# EAGLE design heater (EAGLE 9.2.2)
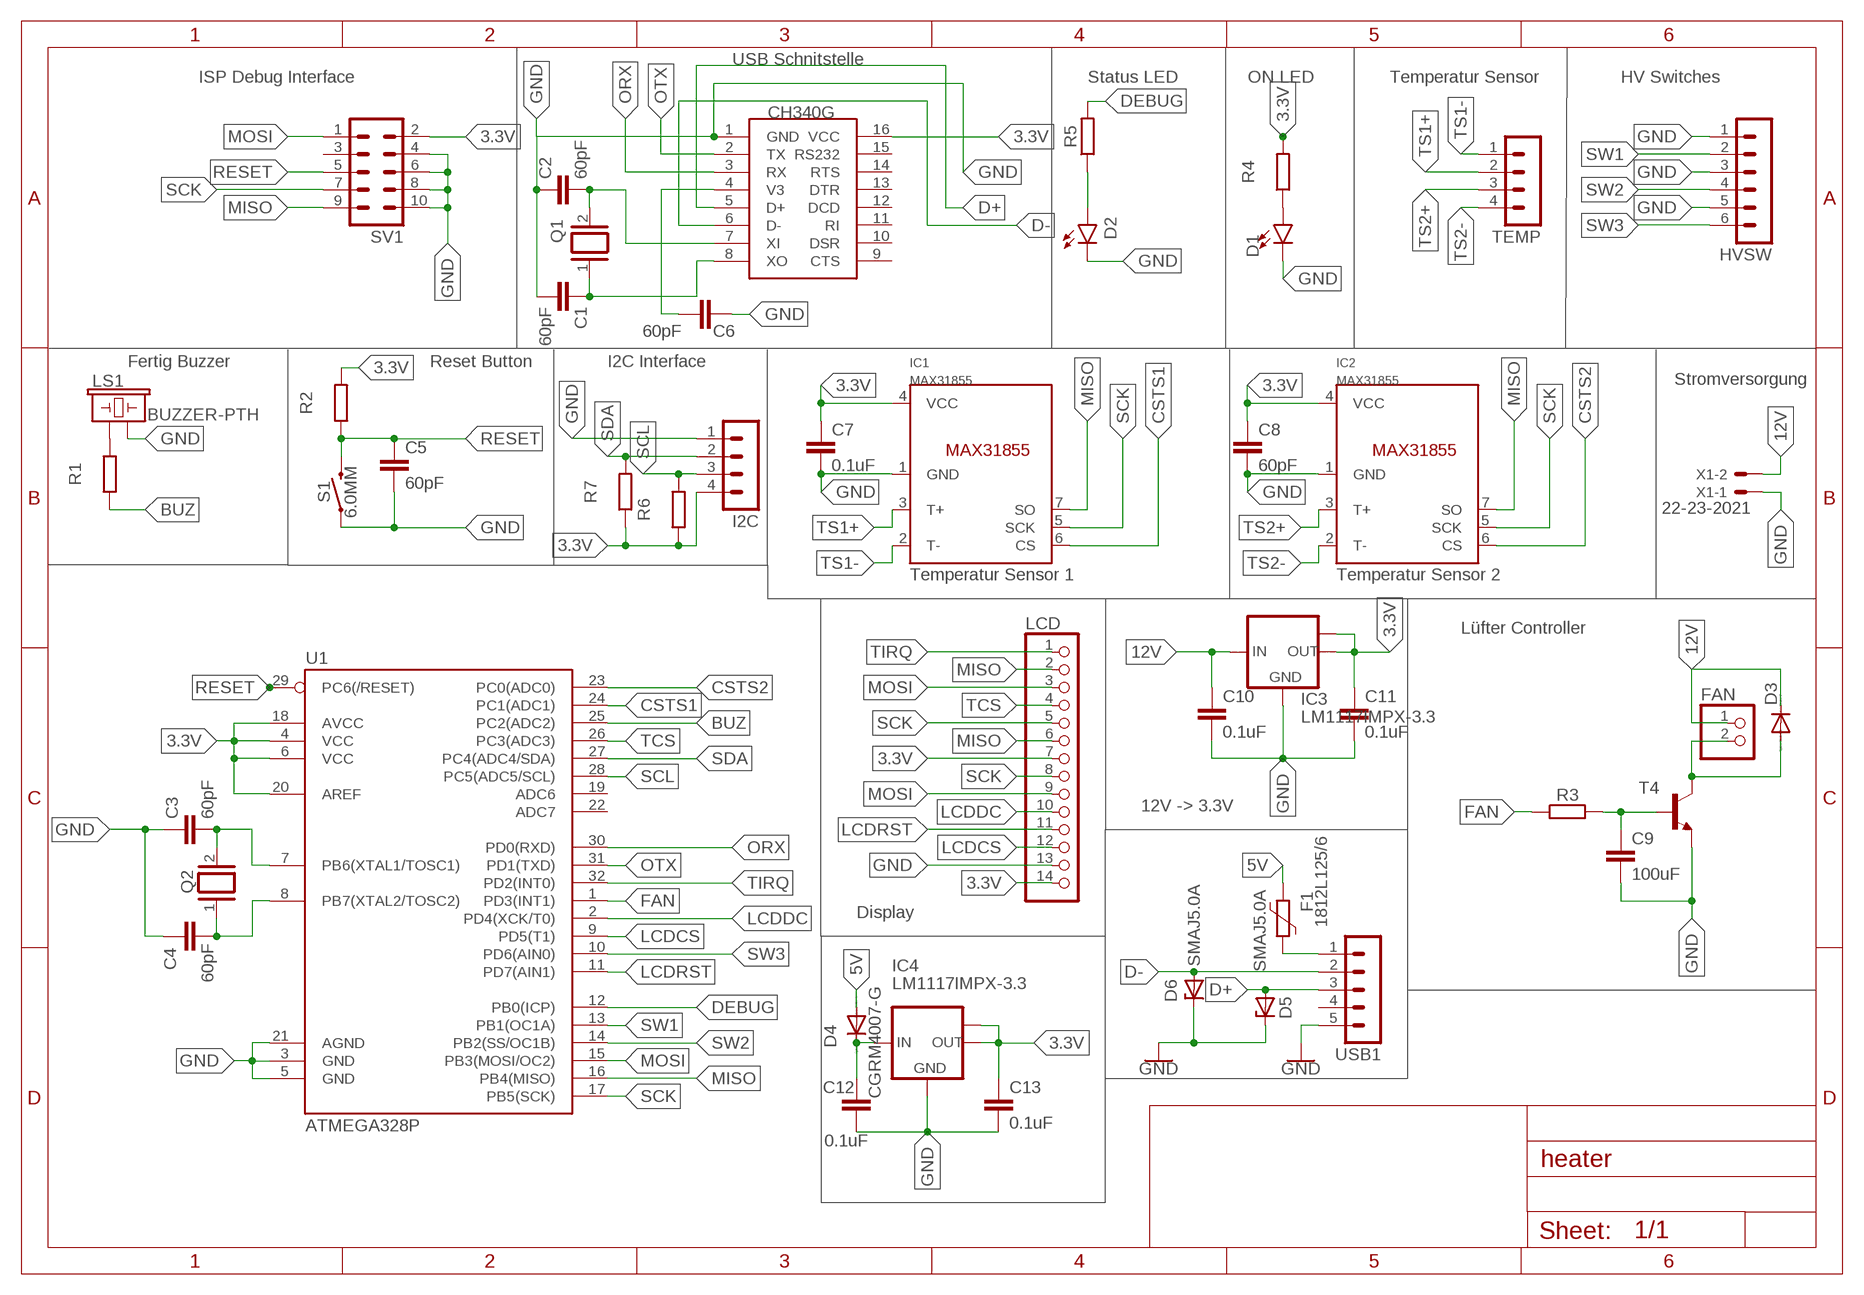
[diagram p0: schematic, sheet 1]

## Parts
C1  60pF  C-EUC0805  [C0805]
C2  60pF  C-EUC0805  [C0805]
C3  60pF  C-EUC0805  [C0805]
C4  60pF  C-EUC0805  [C0805]
C5  60pF  C-EUC0805  [C0805]
C6  60pF  C-EUC0805  [C0805]
C7  0.1uF  C-EUC0805  [C0805]
C8  60pF  C-EUC0805  [C0805]
C9  100uF  C-EUC0805  [C0805]
C10  0.1uF  C-EUC0805  [C0805]
C11  0.1uF  C-EUC0805  [C0805]
C12  0.1uF  C-EUC0805  [C0805]
C13  0.1uF  C-EUC0805  [C0805]
D1  LED5MM  [LED_5MM]
D2  LED5MM  [LED_5MM]
D3  CGRM4007-G  [SOD-123_MINI-SMA]
D4  CGRM4007-G  [SOD-123_MINI-SMA]
D5  SMAJ5.0A  [DO214AC]
D6  SMAJ5.0A  [DO214AC]
F1  1812L125/6  [1812L]
FAN  PINHD-1X2  [1X02]
HVSW  MA06-1  [MA06-1]
I2C  MA04-1  [MA04-1]
IC1  MAX31855  [SOIC8]
IC2  MAX31855  [SOIC8]
IC3  LM1117IMPX-3.3  [SOT223]
IC4  LM1117IMPX-3.3  [SOT223]
LCD  PINHD-1X14  [1X14]
LS1  BUZZER-PTH  [BUZZER-12MM]
Q1  XTAL/S  [QS]
Q2  XTAL/S  [QS]
R1  R-EU_M0805  [M0805]
R2  R-EU_M0805  [M0805]
R3  R-EU_M0805  [M0805]
R4  R-EU_M0805  [M0805]
R5  R-EU_M0805  [M0805]
R6  R-EU_M0805  [M0805]
R7  R-EU_M0805  [M0805]
S1  6.0MM  MOMENTARY-SWITCH-SPST-PTH-6.0MM  [TACTILE_SWITCH_PTH_6.0MM]
SV1  MA05-2  [MA05-2]
T4  TRANSISTOR_2SC2509V  [TRANSISTOR_TO220AV]
TEMP  MA04-1  [MA04-1]
U1  ATMEGA328P  ATMEGA328P_TQFP  [TQFP32-08]
U$1  CH340G  [SOIC16]
USB1  MA05-1  [MA05-1]
X1  22-23-2021  [22-23-2021]

## Nets
3.3V: C7.1 C8.1 C11.1 C13.1 I2C.4 IC1.4(VCC) IC2.4(VCC) IC3.2(OUT) IC3.TAB(OUT1) IC4.2(OUT) IC4.TAB(OUT1) LCD.7 LCD.14 R2.2 R4.2 R6.1 R7.1 SV1.2 U1.4(VCC) U1.6(VCC) U1.18(AVCC) U1.20(AREF) U$1.16(VCC)
5V: D4.A F1.2
12V: C10.1 D3.C FAN.1 IC3.3(IN) X1.2
BUZ: R1.1 U1.25(PC2(ADC2))
CSTS1: IC1.6(CS) U1.24(PC1(ADC1))
CSTS2: IC2.6(CS) U1.23(PC0(ADC0))
D+: D5.A U$1.5(D+) USB1.3
D-: D6.A U$1.6(D-) USB1.2
DEBUG: R5.2 U1.12(PB0(ICP))
FAN: R3.1 U1.1(PD3(INT1))
FAN_PRE: D3.A FAN.2 T4.2(C)
GND: C1.2 C2.1 C3.1 C4.1 C5.2 C6.1 C7.2 C8.2 C9.2 C10.2 C11.2 C12.2 C13.2 D1.K(C) D2.K(C) D5.C D6.C HVSW.1 HVSW.3 HVSW.5 I2C.1 IC1.1(GND) IC2.1(GND) IC3.1(GND) IC4.1(GND) LCD.13 LS1.- S1.1 SV1.4 SV1.6 SV1.8 SV1.10 T4.3(E) U1.3(GND) U1.5(GND) U1.21(AGND) U$1.1(GND) USB1.5 X1.1
LCDCS: LCD.12 U1.9(PD5(T1))
LCDDC: LCD.10 U1.2(PD4(XCK/T0))
LCDRST: LCD.11 U1.11(PD7(AIN1))
MISO: IC1.7(SO) IC2.7(SO) LCD.2 LCD.6 SV1.9 U1.16(PB4(MISO))
MOSI: LCD.3 LCD.9 SV1.1 U1.15(PB3(MOSI/OC2))
N$1: C1.1 Q1.1 U$1.8(XO)
N$4: C2.2 Q1.2 U$1.7(XI)
N$6: C12.1 D4.C IC4.3(IN)
N$7: LS1.+ R1.2
N$8: C6.2 U$1.4(V3)
N$9: C9.1 R3.2 T4.1(B)
N$21: D1.A R4.1
N$22: D2.A R5.1
ORX: U1.30(PD0(RXD)) U$1.3(RX)
OTX: U1.31(PD1(TXD)) U$1.2(TX)
PRE5V: F1.1 USB1.1
RESET: C5.1 R2.1 S1.3 SV1.5 U1.29(PC6(/RESET))
SCK: IC1.5(SCK) IC2.5(SCK) LCD.5 LCD.8 SV1.7 U1.17(PB5(SCK))
SCL: I2C.3 R6.2 U1.28(PC5(ADC5/SCL))
SDA: I2C.2 R7.2 U1.27(PC4(ADC4/SDA))
SW1: HVSW.2 U1.13(PB1(OC1A))
SW2: HVSW.4 U1.14(PB2(SS/OC1B))
SW3: HVSW.6 U1.10(PD6(AIN0))
TCS: LCD.4 U1.26(PC3(ADC3))
TIRQ: LCD.1 U1.32(PD2(INT0))
TS1+: IC1.3(T+) TEMP.2
TS1-: IC1.2(T-) TEMP.1
TS2+: IC2.3(T+) TEMP.3
TS2-: IC2.2(T-) TEMP.4
XTAL1: C4.2 Q2.1 U1.8(PB7(XTAL2/TOSC2))
XTAL2: C3.2 Q2.2 U1.7(PB6(XTAL1/TOSC1))
Unconnected: SV1.3 U1.19(ADC6) U1.22(ADC7) U$1.9(CTS) U$1.10(DSR) U$1.11(RI) U$1.12(DCD) U$1.13(DTR) U$1.14(RTS) U$1.15(RS232) USB1.4

## Notes on the sheet
- USB Schnitstelle
- ISP Debug Interface | Status LED | ON LED | Temperatur Sensor | HV Switches
- Fertig Buzzer | Reset Button | I2C Interface
- Stromversorgung
- Temperatur Sensor 1 | Temperatur Sensor 2
- Lüfter Controller
- 12V -> 3.3V
- Display

## Library data of the parts
C1-C13 = rcl:C-EU: CAPACITOR, European symbol; SPICEPREFIX: C
D1 D2 = SparkFun-LED:LED: LED (Generic) Standard schematic elements and footprints for 5mm, 3mm, 1206, and 0603 sized LEDs. Generic LEDs with no color specified.
D3 D4 = diode:CGRM400*-G: Molded plasitc,JEDEC SOD-123/Mini SMA Source: Comchip CGRM4001-G.pdf
D5 D6 = smaj_10:SMAJ*A: SMAJ Series TVS Diodes Source: http://www.littelfuse.com/~/media/electronics/datasheets/tvs_diodes/littelfuse_tvs_diode_smaj_datasheet.pdf.pdf; MF: Littelfuse; MPN: SMAJ5.0A; OC_FARNELL: 1827607; OC_NEWARK: 71J2029
F1 = polyfuse-smd_10:?: Polyfuse Resettable PTC Source: http://www.littelfuse.com/products/resettable-ptcs.aspx; MF: Littelfuse; MPN: 1812L125/6; OC_FARNELL: unknown; OC_NEWARK: unknown
FAN = pinhead:PINHD-1X2: PIN HEADER
HVSW = con-lstb:MA06-1: PIN HEADER; OC_FARNELL: unknown; OC_NEWARK: unknown
I2C TEMP = con-lstb:MA04-1: PIN HEADER; OC_FARNELL: unknown; OC_NEWARK: unknown
IC1 IC2 = AlexW-Eagle-Libraries:MAX31855
IC3 IC4 = lm1117:LM1117IMPX-*
LCD = pinhead:PINHD-1X14: PIN HEADER
LS1 = SparkFun-Electromechanical:BUZZER: Buzzer Small round buzzers that operate around the audible 2kHz range. You can use these as speakers to create simple music or user interfaces. Variant Overview: PTH - Mini Speaker - PC Mount 12mm 2.048kHz <https://www.sparkfun.com/products/7950> PTH_KIT - Mini Speaker - PC Mount 12mm 2.048kHz <https://www.sparkfun.com/products/7950> KIT simplifies soldering by adding stop mask to one side of the pads. PTH_NO_SILK - Mini Speaker - PC Mount 12mm 2.048kHz <https://www.sparkfun.com/products/7950> No silkscreen indicator of buzzer outline. PTH_KIT_NO_SILK - Mini Speaker - PC Mount 12mm 2.048kHz <https://www.sparkfun.com/products/7950> KIT package w/o silkscreen SMD - Buzzer Audio Magnetic (CCV-084B16) SMD buzzer used on, e.g. the LilyPad Buzzer <https://www.sparkfun.com/products/8463> and RFID USB Reader <https://www.sparkfun.com/products/9963>. SMD_KIT - Buzzer Audio Magnetic (CCV-084B16) SMD Buzzer with elongated pins to make soldering easier. Used on the SparkFun Simon Says - Surface Mount Soldering Kit <https://www.sparkfun.com/products/10935>.; PROD_ID: COMP-08253; SF_SKU: COM-07950
Q1 Q2 = special:XTAL/S: CRYSTAL
R1-R7 = rcl:R-EU_: RESISTOR, European symbol; SPICEPREFIX: R
S1 = SparkFun-Switches:MOMENTARY-SWITCH-SPST: Momentary Switch (Pushbutton) - SPST Normally-open (NO) SPST momentary switches (buttons, pushbuttons). Variants PTH-12MM - 12mm square, through-hole Momentary Pushbutton Switch - 12mm Square <https://www.sparkfun.com/products/9190> (COM-09190) PTH-6.0MM, PTH-6.0MM-KIT - 6.0mm square, through-hole Mini Pushbutton Switch <https://www.sparkfun.com/products/97> (COM-00097) KIT package intended for soldering kit's - only one side of pads' copper is exposed. PTH-RIGHT-ANGLE-KIT - Right-angle, through-hole Right Angle Tactile Button <https://www.sparkfun.com/products/10791> - Used on SparkFun BigTime Watch Kit <https://www.sparkfun.com/products/11734> SMD-12MM - 12mm square, surface-mount Tactile Button - SMD (12mm) <https://www.sparkfun.com/products/12993> (COM-12993) Used on SparkFun PicoBoard <https://www.sparkfun.com/products/11888> SMD-4.5MM - 4.5mm Square Trackball Switch Used on SparkFun Blackberry Trackballer Breakout <https://www.sparkfun.com/products/13169> SMD-4.6MMX2.8MM - 4.60mm x 2.80mm, surface mount Used on SparkFun SAMD21 Mini Breakout <https://www.sparkfun.com/products/13664> SMD-5.2MM, SMD-5.2-REDUNDANT - 5.2mm square, surface-mount Mini Pushbutton Switch - SMD <https://www.sparkfun.com/products/8720> (COM-08720) Used on Arduino Pro Mini <https://www.sparkfun.com/products/11114> REDUNDANT package connects both switch circuits together SMD-6.0X3.5MM - 6.0 x 3.5mm, surface mount Momentary Reset Switch SMD <https://www.sparkfun.com/products/8229> (COM-08229) SMD-6.2MM-TALL - 6.2mm square, surface mount Tactile Button - SMD (6mm) <https://www.sparkfun.com/products/12992> Used on SparkFun Digital Sandbox <https://www.sparkfun.com/products/12651> SMD-RIGHT-ANGLE - Right-angle, surface mount Used on SparkFun Block for Intel® Edison - Arduino <https://www.sparkfun.com/products/13036>; PROD_ID: SWCH-08441; SF_SKU: COM-00097
SV1 = con-lstb:MA05-2: PIN HEADER; OC_FARNELL: unknown; OC_NEWARK: unknown
T4 = rgb:TRANSISTOR_2SC2509: NPN Epitaxial Planar Transistor RF Power Amplivier Source: www.Datasheet4U.com 2SC2905.pdf
U1 = SparkFun-IC-Microcontroller:ATMEGA328P_TQFP: Popular 328P in QFP Storefront component: ATmega328 - TQFP <https://www.sparkfun.com/products/13448> (COM-13448) Datasheet <http://www.sparkfun.com/datasheets/Components/SMD/ATMega328.pdf> SparkFun Products SparkFun RedBoard - Programmed with Arduino <https://www.sparkfun.com/products/12757> (DEV-12757) Arduino Pro Mini 328 - 5V/16MHz <https://www.sparkfun.com/products/11113> (DEV-11113) Arduino Pro Mini 328 - 3.3V/8MHz <https://www.sparkfun.com/products/11114> (DEV-11114) SparkFun OpenLog <https://www.sparkfun.com/products/13712> (DEV-13712) SparkFun MicroView - OLED Arduino Module <https://www.sparkfun.com/products/12923> (DEV-12923) SparkFun Digital Sandbox <https://www.sparkfun.com/products/12651> (DEV-12651) SparkFun PicoBoard <https://www.sparkfun.com/products/11888> (WIG-11888) Arduino Fio <https://www.sparkfun.com/products/10116> (DEV-10116) LilyPad Arduino 328 Main Board <https://www.sparkfun.com/products/13342> (DEV-13342) SparkFun RedStick <https://www.sparkfun.com/products/13741> (DEV-13741) LilyPad MP3 <https://www.sparkfun.com/products/11013> (DEV-11013) LilyPad Arduino SimpleSnap <https://www.sparkfun.com/products/10941> (DEV-10941) SparkFun Stepoko <https://www.sparkfun.com/products/13899> (ROB-13899) SparkFun Geiger Counter <https://www.sparkfun.com/products/11345> (SEN-11345) SparkFun EL Sequencer <https://www.sparkfun.com/products/12781> (COM-12781) Arduino Pro 328 - 5V/16MHz <https://www.sparkfun.com/products/10915> (DEV-10915) CryptoCape <https://www.sparkfun.com/products/12773> (DEV-12773) SparkFun IR Thermometer Evaluation Board - MLX90614 <https://www.sparkfun.com/products/10740> (SEN-10740) SparkFun RedBot Mainboard <https://www.sparkfun.com/products/12097> (ROB-12097) Arduino Pro 328 - 3.3V/8MHz <https://www.sparkfun.com/products/10914> (DEV-10914) SparkFun Block for Intel® Edison - Arduino <https://www.sparkfun.com/products/13036> (DEV-13036) SparkFun Simon Says - Surface Mount Soldering Kit <https://www.sparkfun.com/products/10935> (KIT-10935) SparkFun 7-Segment Serial Display - Red <https://www.sparkfun.com/products/11441> (COM-11441) SparkFun 7-Segment Serial Display - White <https://www.sparkfun.com/products/11629> (COM-11629) SparkFun 7-Segment Serial Display - Yellow <https://www.sparkfun.com/products/11443> (COM-11443) SparkFun 7-Segment Serial Display - Kelly Green <https://www.sparkfun.com/products/11440> (COM-11440) SparkFun 7-Segment Serial Display - Blue <https://www.sparkfun.com/products/11442> (COM-11442) SparkFun OpenSegment Serial Display - 20mm (Blue) <https://www.sparkfun.com/products/11647> (COM-11647) SparkFun OpenSegment Serial Display - 20mm (Green) <https://www.sparkfun.com/products/11646> (COM-11646) SparkFun OpenSegment Serial Display - 20mm (White) <https://www.sparkfun.com/products/11648> (COM-11648) SparkFun OpenSegment Serial Display - 20mm (Red) <https://www.sparkfun.com/products/11644> (COM-11644) SparkFun OpenSegment Serial Display - 20mm (Yellow) <https://www.sparkfun.com/products/11645> (COM-11645) SparkFun OpenSegment Shield <https://www.sparkfun.com/products/13190> (DEV-13190); PROD_ID: IC-09069; VALUE: ATMEGA328P_TQFP
U$1 = ch340g:CH340G
USB1 = con-lstb:MA05-1: PIN HEADER; OC_FARNELL: unknown; OC_NEWARK: unknown
X1 = con-molex:22-23-2021: .100" (2.54mm) Center Header - 2 Pin; MF: MOLEX; MPN: 22-23-2021; OC_FARNELL: 1462926; OC_NEWARK: 25C3832

## Board
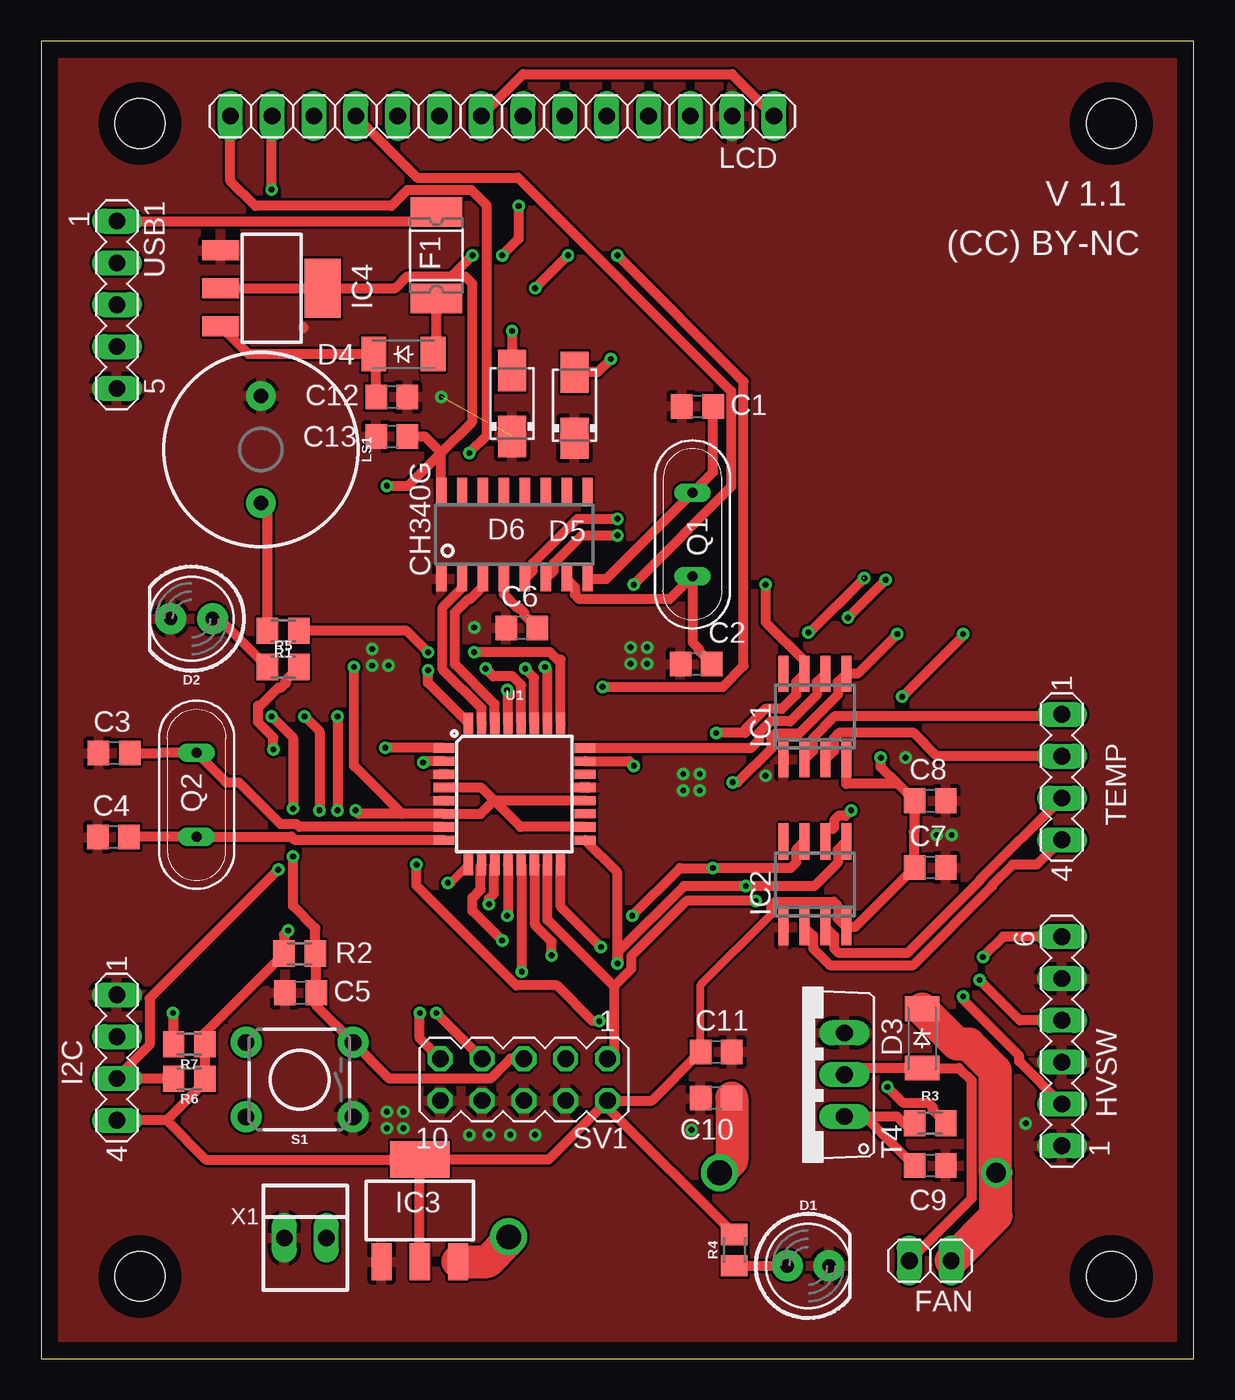
[diagram p1: board, top side]
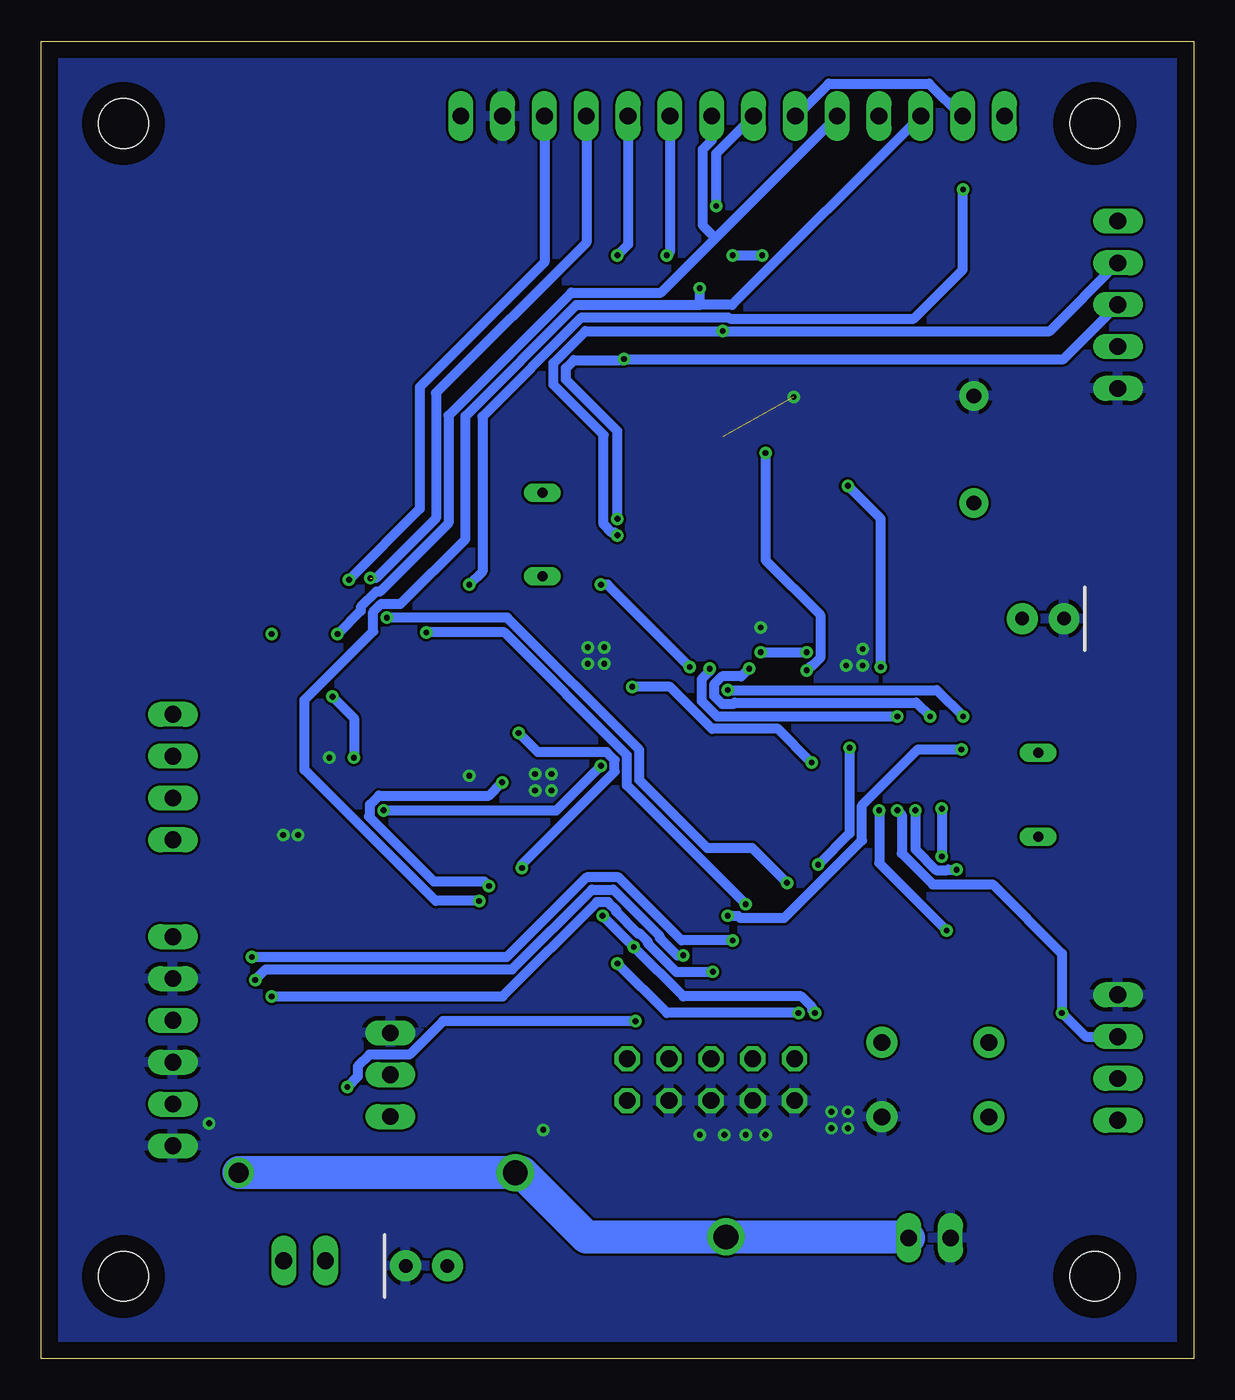
[diagram p2: board, bottom side, seen from below]

Size 70 x 80 mm. Coordinates in mm from the lower left corner, seen from the top.
Outline: 0,0 70,0 70,80 0,80 0,0
Copper layers (1*16): Top 0.035mm / dielectric 1.5mm / Bottom 0.035mm
Design rules "default": minimum track width 6mil, minimum drill 0.35mm, track to track 6mil, track to pad 6mil, pad to pad 6mil, via to via 6mil, smd to smd 6mil, copper to edge 40mil, drill to drill 6mil, minimum pad ring 10mil, minimum via ring 8mil, stop-mask expansion 4mil, vias tented up to drill 0mil, thermal gap 10mil
Holes 3 mm at 65,5 6,5 6,75 65,75

### Footprints (pad centres in the part's own frame; a part is rotated, then mirrored left to right if it is on the bottom)
C0805 = smd 1.3 x 1.5: 1 -0.95,0; 2 0.95,0
LED_5MM = drill 0.813 pad 1.88: A -1.27,0; K 1.27,0
SOD-123_MINI-SMA = smd 1.5 x 2.1: A 1.8,0; C -1.8,0
DO214AC = smd 2.5 x 1.7: A 2,0; C -2,0
1812L = smd 1.78 x 3.15: 1 -2.62,0; 2 2.62,0
1X02 = drill 1.016 long: 1 -1.27,0; 2 1.27,0
MA06-1 = drill 1.016 long: 1 -6.35,0; 2 -3.81,0; 3 -1.27,0; 4 1.27,0; 5 3.81,0; 6 6.35,0
MA04-1 = drill 1.016 long: 1 -3.81,0; 2 -1.27,0; 3 1.27,0; 4 3.81,0
SOIC8 = smd 0.6 x 2.2: 1 -1.905,-2.6; 2 -0.635,-2.6; 3 0.635,-2.6; 4 1.905,-2.6; 5 1.905,2.6; 6 0.635,2.6; 7 -0.635,2.6; 8 -1.905,2.6
SOT223 = smd 1.219 x 2.235: 1 -2.311,-3.099; 2 0,-3.099; 3 2.311,-3.099 | smd 3.6 x 2.2: TAB 0,3.099
1X14 = drill 1.016 long: 1 -16.51,0; 2 -13.97,0; 3 -11.43,0; 4 -8.89,0; 5 -6.35,0; 6 -3.81,0; 7 -1.27,0; 8 1.27,0; 9 3.81,0; 10 6.35,0; 11 8.89,0; 12 11.43,0; 13 13.97,0; 14 16.51,0
BUZZER-12MM = drill 0.9 pad 1.778: + 3.25,0; - -3.25,0
QS = drill 0.61 long: 1 -2.54,0; 2 2.54,0
M0805 = smd 1.3 x 1.6: 1 -0.95,0; 2 0.95,0
TACTILE_SWITCH_PTH_6.0MM = drill 1.016 pad 1.88: 1 -3.251,2.261; 2 3.251,2.261; 3 -3.251,-2.261; 4 3.251,-2.261
MA05-2 = drill 1.016 octagon: 1 -5.08,-1.27; 2 -5.08,1.27; 3 -2.54,-1.27; 4 -2.54,1.27; 5 0,-1.27; 6 0,1.27; 7 2.54,-1.27; 8 2.54,1.27; 9 5.08,-1.27; 10 5.08,1.27
TRANSISTOR_TO220AV = drill 1.016 long: 1 -2.54,-2.54; 2 0,-2.54; 3 2.54,-2.54
TQFP32-08 = smd 1.27 x 0.559: 1 -4.293,2.8; 2 -4.293,2; 3 -4.293,1.2; 4 -4.293,0.4; 5 -4.293,-0.4; 6 -4.293,-1.2; 7 -4.293,-2; 8 -4.293,-2.8; 17 4.293,-2.8; 18 4.293,-2; 19 4.293,-1.2; 20 4.293,-0.4; 21 4.293,0.4; 22 4.293,1.2; 23 4.293,2; 24 4.293,2.8 | smd 0.559 x 1.27: 9 -2.8,-4.293; 10 -2,-4.293; 11 -1.2,-4.293; 12 -0.4,-4.293; 13 0.4,-4.293; 14 1.2,-4.293; 15 2,-4.293; 16 2.8,-4.293; 25 2.8,4.293; 26 2,4.293; 27 1.2,4.293; 28 0.4,4.293; 29 -0.4,4.293; 30 -1.2,4.293; 31 -2,4.293; 32 -2.8,4.293
SOIC16 = smd 0.635 x 1.524: 1 -4.445,-2.695; 2 -3.175,-2.695; 3 -1.905,-2.695; 4 -0.635,-2.695; 5 0.635,-2.695; 6 1.905,-2.695; 7 3.175,-2.695; 8 4.445,-2.695; 9 4.445,2.695; 10 3.175,2.695; 11 1.905,2.695; 12 0.635,2.695; 13 -0.635,2.695; 14 -1.905,2.695; 15 -3.175,2.695; 16 -4.445,2.695
MA05-1 = drill 1.016 long: 1 -5.08,0; 2 -2.54,0; 3 0,0; 4 2.54,0; 5 5.08,0
22-23-2021 = drill 1 long: 1 -1.27,0; 2 1.27,0

### Placement (x,y rotation side)
C1  39.86,57.82 180 top
C2  39.79,42.18 0 top
C3  4.44,36.78 0 top
C4  4.39,31.68 0 top
C5  15.76,22.22 180 top
C6  29.19,44.38 0 top
C7  54,29.83 0 top
C8  54,33.88 0 top
C9  54,11.73 0 top
C10  41,15.83 180 top
C11  41,18.63 0 top
C12  21.3,58.4 0 top
C13  21.3,56 180 top
D1  46.59,5.64 0 top
D2  9.14,44.94 180 top
D3  53.5,19.45 270 top
D4  22,61 0 top
D5  32.4,57.9 90 top
D6  28.6,58 90 top
F1  24,67 270 top
FAN  54,5.96 180 top
HVSW  62,19.28 90 top
I2C  4.6,18.29 270 top
IC1  47,39 0 top
IC2  47,28.81 0 top
IC3  23,9 0 top
IC4  14,65 270 top
LCD  28,75.45 0 top
LS1  13.35,55.21 270 top
Q1  39.56,50.05 270 top
Q2  9.44,34.25 90 top
R1  14.7,44.2 180 top
R2  15.7,24.6 180 top
R3  54,14.3 180 top
R4  42.1,6.6 90 top
R5  14.7,42 0 top
R6  9,17 180 top
R7  9,19.1 180 top
S1  15.69,16.95 180 top
SV1  29.32,16.95 180 top
T4  46.25,17.25 90 top
TEMP  62,35.32 270 top
U1  28.75,34.29 0 top
U$1  28.74,50.05 0 top
USB1  4.6,64 270 top
X1  16.04,7.35 0 top

### Tracks (layer width: path | path; a pad name or v marks a point on that pad's centre or on a via)
3.3V  (via drill 0.35)
  Top 0.5: C11.1 40.05,22.71 44.34,27
  Top 0.6: IC1.4 48.91,34.91 52.02,34.91 | 52.02,34.91 C8.1 53.05,32.05 53,32 53,29.88 C7.1 49.43,26.21 IC2.4 48.39,26.73 48.39,27.5 48.12,27.76 44.61,27.76 44.34,27.5 44.34,27 | 24.3,55 U$1.16 | U1.20 27.5,33.9 | U1.4 26.71,34.69 27.5,33.9 | 27.5,33.9 26.69,33.09 U1.6 21.91,33.09 | 7.62,14.48 I2C.4 | SV1.2 37.1,15.68 C11.1 | 52.02,34.91 51,35.93 v51,36.5 | v19,42 19,36 21.91,33.09 | v21,53 22.3,53 24.3,55 | 21.91,33.09 19.31,33.09 v19.1,33.3 | v15,26 14.75,25.75 R2.2 9.95,19.8 R7.1 R6.1 9.95,16.81 7.62,14.48 | 56.06,43.94 v56,44 56,43.9 v52.3,40.2 | U1.18 29.11,32.29 27.5,33.9 | SV1.2 30.82,12.1 IC3.TAB | IC3.2 IC3.TAB | 24.3,55 26.2,56.9 26.2,65.28 25.76,65.72 24.92,65.72 | C13.1 23.3,56 24.3,55 | 7.62,14.48 10,12.1 IC3.TAB | R4.2 34.4,15.25 SV1.2 | IC4.2 IC4.TAB 21.52,65 22.24,65.72 24.92,65.72 | v29,70 29,68 v28,67 | v26.2,67 24.92,65.72 | LCD.14 41.96,78 29.28,78 LCD.7
  Bottom 0.6: v52.3,40.2 51,38.9 v51,36.5 | v19,42 19,51 v21,53 | v19.1,33.3 19.1,30.1 v15,26 | LCD.7 29,73.18 v29,70 | v28,67 v26.2,67 26.1,67
5V
  Top 0.6: F1.2 24,61.2 D4.A
12V  (via drill 1.2, 1.5)
  Top 2: D3.C 55.65,19.1 56.35,19.1 57.95,17.5 57.95,11.35 v58,11.3 58,8.69 FAN.1 | IC3.3 27.1,5.9 28.4,7.2 v28.4,7.4 | v41.2,11.3 41.95,12.05 C10.1
  Bottom 2: X1.2 17.36,7.4 v28.4,7.4 36.9,7.4 40.8,11.3 v41.2,11.3 v58,11.3
BUZ  (via drill 0.35)
  Top 0.6: U1.25 31.55,42.45 31.35,42.45 30.9,42.9 v26.3,42.9 | v23.5,42.9 22.2,44.2 R1.1
  Bottom 0.6: v26.3,42.9 v23.5,42.9
CSTS1
  Top 0.6: IC1.6 47.12,41.08 47.12,40.31 45.51,38.7 44.3,38.7 43.59,38 43.59,37.55 43.13,37.1 40.1,37.1 40.09,37.09 U1.24
CSTS2  (via drill 0.35)
  Top 0.6: U1.23 35.71,36.29 v36,36 | IC2.6 47.63,32.18 48.08,32.18 48.15,32.25 48.15,32.7 48.42,32.96 48.86,32.96 v49.2,33.3
  Bottom 0.6: v36,36 38.7,33.3 v49.2,33.3
D+  (via drill 0.35)
  Top 0.6: U$1.5 29.88,47.85 29.88,48.3 32.57,51 v35,51 | v34.6,60.7 33.8,59.9 D5.A
  Bottom 0.6: v35,51 35,56.33 38.13,59.46 38.13,60.14 37.64,60.63 34.67,60.63 v34.6,60.7 7.9,60.7 USB1.3
D-  (via drill 0.35)
  Top 0.6: U$1.6 31.14,47.85 31.14,48.3 32.84,50 v35,50 | v28.6,62.4 D6.A
  Bottom 0.6: v35,50 35.17,50.17 35.34,50.17 35.83,50.66 35.83,56.09 38.88,59.14 38.88,60.46 36.94,62.4 v28.6,62.4 8.74,62.4 USB1.2
DEBUG  (via drill 0.35)
  Top 0.6: U1.12 28.35,26.95 v28.3,26.9 | v14.1,37 14.1,37.73 13.17,38.66 13.17,39.67 13.32,39.67 14.4,40.75 14.59,40.75 14.85,41.01 14.85,41.2 R5.2
  Bottom 0.6: v28.3,26.9 27.68,26.9 27.54,26.77 24.86,26.77 20.15,31.48 20.15,33.6 16.75,37 v14.1,37
FAN  (via drill 0.35)
  Top 0.6: U1.1 v20.91,37.09 v20.9,37.1 | v51.4,16.5 52.35,15.55 53.89,15.55 54.15,15.29 54.15,15.1 R3.1 | v22.8,30 22.8,28.73 28.86,22.67 31.33,22.67 33.5,20.5 v33.9,20.5
  Bottom 0.6: v20.9,37.1 20.9,31.9 v22.8,30 | v51.4,16.5 50.77,17.13 50.77,17.75 50.05,18.46 47.64,18.46 45.6,20.5 v33.9,20.5
FAN_PRE
  Top 0.6: T4.2 49.19,17.65 D3.A 55.75,17.65 56.5,16.9 56.5,9.73 FAN.2
GND  (via drill 0.35)  (1 unrouted)
  Top 0.6: 15.94,62.65 15.94,62.6
  other vias: 44,35.4 36.8,42.2 26.3,44.4 39,35.5 20.1,43.1 52.5,36.5 54.4,31.8 55.3,31.8 24.3,58.4 39.5,13.9 26,13.6 27.2,13.6 28.5,13.6 30,13.6 59.8,14.3 20.1,42.1 21.1,42.1 36.8,43.2 35.8,43.2 35.8,42.2 40,35.5 39,34.5 40,34.5 21,15 22,15 21,14 22,14
  pour Top: -1,81 -1,-1 71,-1 71,81
  pour Bottom: -2,82 -2,-2 73,-2 73,82
LCDCS  (via drill 0.35)
  Top 0.5: U1.9 24.85,28.9
  Top 0.6: 24.85,28.9 v24.7,28.9 | v49,45 v51.3,47.3
  Bottom 0.6: v24.7,28.9 26.8,31 29.54,31 33.66,35.13 33.66,36.97 41.7,45 v49,45 | LCD.12 39.43,66.57 47,59 47,51.6 v51.3,47.3
LCDDC  (via drill 0.35)
  Top 0.6: U1.2 23.29,36.29 v23.2,36.2 | v35,67 42.66,59.34 42.66,42.06 41.4,40.8 v34.1,40.8
  Bottom 0.6: v34.1,40.8 31.8,40.8 29.25,38.25 25.25,38.25 v23.2,36.2 | v35,67 34.35,67.65 LCD.10
LCDRST  (via drill 0.35)  (1 unrouted)
  Top 0.6: v27.2,27.6 27.2,27.94 27.5,28.24 27.5,29.95 U1.11 | v46.6,44.1 46.7,44.1 v50,47.4
  Bottom 0.6: v27.2,27.6 34.42,34.82 34.42,36.66 41.86,44.1 v46.6,44.1 | LCD.11 36.89,67.77 46.02,58.64 46.02,51.05 49.66,47.4 49.9,47.4
MISO  (via drill 0.35)
  Top 0.6: v41,38 42.77,38 42.84,38.07 42.84,38.31 43.98,39.46 44.99,39.46 45.85,40.31 45.85,41.08 IC1.7 46.37,42.37 44,44.73 v44,47 | IC2.7 45.85,30.89 45.85,30.12 45.52,29.8 v40.8,29.8 38.8,29.8 v35.9,26.9 | SV1.9 23,19.46 v23,21 | v34,25 31.55,27.45 U1.16 | v14,71 14,75.42 LCD.2
  Bottom 0.6: v41,38 39.83,36.83 35.66,36.83 35.17,36.34 35.17,35.66 40.8,30.02 v40.8,29.8 | v23,21 23.17,21.17 23.17,21.34 23.82,22 31,22 v34,25 v35.9,26.9 | LCD.6 24.13,75.45 22.15,77.43 16.07,77.43 14.09,75.45 LCD.2 | v14,71 14.03,70.97 14.03,66.12 17,63.15 28.18,63.15 28.26,63.23 37.17,63.23 43.2,57.2 43.2,47.8 v44,47
MOSI  (via drill 0.35)
  Top 0.6: 34.79,22.61 30.75,26.65 U1.15 | v43.4,27.8 39.2,27.8 35.83,24.43 35.83,23.66 34.79,22.61 | 34.79,22.61 34.79,18.61 SV1.1 | v32,67 v30,65
  Bottom 0.6: v43.4,27.8 46.04,27.8 54,35.76 54,40 49.83,44.17 49.83,45.34 49.34,45.83 48.17,45.83 44.23,49.77 44.23,57.23 37.48,63.98 30,63.98 | LCD.3 28.04,63.98 30,63.98 | LCD.9 31.81,67.19 v32,67 | v30,65 30,63.98
N$1
  Top 0.6: U$1.8 34.33,47.35 Q1.1 40.81,53.84 C1.1
N$4
  Top 0.6: U$1.7 32.41,46.85 32.41,46.41 32.68,46.14 38.19,46.14 Q1.2 39.56,43.5 39.94,43.12 39.94,42.98 C2.2
N$6
  Top 0.6: C12.1 20.35,60.85 D4.C 12.59,61 IC4.3
N$7
  Top 0.6: R1.2 13.75,51.56 LS1.+
N$8
  Top 0.6: U$1.4 28.11,46.41 28.94,45.58 29.08,45.58 29.34,45.32 29.34,45.18 C6.2
N$9
  Top 0.6: C9.1 50.07,14.71 | 50.07,14.71 T4.1 | 50.07,14.71 52,14.71 52.41,14.3 R3.2
N$21
  Top 0.6: R4.1 D1.A
N$22
  Top 0.6: R5.1 10.81,44.94 D2.A
ORX
  Top 0.6: U1.30 27.55,39.75 25.14,42.16 25.14,45.32 25.96,46.14 26.07,46.14 26.84,46.91 U$1.3
OTX
  Top 0.6: U$1.2 25.57,46.81 24.39,45.63 24.39,41.85 26.75,39.49 U1.31
PRE5V
  Top 0.6: USB1.1 23.46,69.08 F1.1
RESET  (via drill 0.35)
  Top 0.6: U1.29 28.35,40.55 v28.3,40.6 | v14,39 15.3,37.7 v15.3,33.4 | v15.3,30.5 15.3,27.5 16.65,26.15 R2.1 16.71,24.54 C5.1 16.71,21.44 S1.3 21.15,17.01 27.28,17.01 28.5,18.22 SV1.5
  Bottom 0.6: v28.3,40.6 15.6,40.6 v14,39 | v15.3,33.4 v15.3,30.5
SCK  (via drill 0.35)
  Top 0.6: v42,35 42.3,35 44.34,37.04 44.34,37.69 44.61,37.95 46.03,37.95 48.39,40.31 48.39,41.08 IC1.5 49.6,41.6 v52,44 | IC2.5 48.39,30.89 48.39,30.12 46.97,28.7 v42.8,28.7 39.04,28.7 35.08,24.74 35.08,24.08 v35,24 35,29.53 U1.17 | SV1.7 v24,21
  Bottom 0.6: v42,35 42.8,34.2 49.48,34.2 50.03,33.64 50.03,32.97 50.09,32.91 46.14,28.97 43.07,28.97 v42.8,28.7 | v24,21 32,21 v35,24 | LCD.5 29.05,68.05 | 29.05,68.05 32.37,64.73 37.8,64.73 45.27,57.27 45.27,50.73 49.42,46.58 49.66,46.58 50.58,45.66 50.58,45.42 v52,44 | LCD.8 29.27,73.97 29.83,73.41 29.83,68.83 29.05,68.05
SCL  (via drill 0.35)
  Top 0.6: v27,41.9 27.47,41.43 28.64,41.43 29.15,40.92 U1.28 | v16,39 16.9,38.1 v16.9,33.3 | v14.4,29.7 6.59,21.89 6.59,19.06 4.61,17.08 | 4.61,17.08 I2C.3 | R6.2 4.69,17 4.61,17.08
  Bottom 0.6: v27,41.9 27.47,41.43 28.64,41.43 29.13,40.94 29.13,40.26 28.64,39.77 27.96,39.77 27.88,39.85 16.85,39.85 v16,39 | v14.4,29.7 14.93,29.7 14.96,29.67 15.64,29.67 16.9,30.93 v16.9,33.3
SDA  (via drill 0.35)
  Top 0.6: U1.27 29.95,41.35 v29.4,41.9 | v18,39 v18,33.3 | R7.2 8.05,20.95 v8,21
  Bottom 0.6: v29.4,41.9 29.4,41.74 29.88,41.26 29.88,39.94 28.94,39 v18,39 | v18,33.3 17.73,33.03 17.73,30.69 15.84,28.8 12.2,28.8 8,24.6 v8,21 6.56,19.56 I2C.2
SW1  (via drill 0.35)
  Top 0.6: HVSW.2 59.41,18.07 59.41,18.4 56,21.8 v56,22 | v29.2,23.5 29.2,29.68 29.2,29.69 29.2,29.95 U1.13
  Bottom 0.6: v29.2,23.5 31.44,23.5 33.17,25.23 33.17,25.34 33.66,25.83 33.77,25.83 35.07,27.13 35.07,27.24 35.56,27.73 36.24,27.73 41.98,22 v56,22
SW2  (via drill 0.35)
  Top 0.6: HVSW.4 59.45,20.55 v57,23 | v31,24.5 31,25.34 30,26.34 30,29.95 U1.14
  Bottom 0.6: v57,23 56.35,23.65 41.39,23.65 36.56,28.48 35.24,28.48 32.42,25.66 32.42,25.55 31.37,24.5 v31,24.5
SW3  (via drill 0.35)
  Top 0.6: HVSW.6 58.43,25.63 v57.2,24.4 | U1.10 26.7,29.95 26.7,28.5 26.2,28 26.2,27.2 v28,25.4
  Bottom 0.6: v28,25.4 31.1,25.4 34.93,29.23 36.87,29.23 41.7,24.4 v57.2,24.4
TCS  (via drill 0.35)
  Top 0.6: U1.26 30.75,41.85 v30.6,42 | LCD.4 22.84,71.72 28.95,71.72 41.91,58.76 41.91,52.95 36,47.04 v36,47
  Bottom 0.6: v30.6,42 35.6,47 v36,47
TIRQ  (via drill 0.35)
  Top 0.6: U1.32 23.5,41.03 v23.5,41.8 | LCD.1 11.49,71.51 13,70 21.27,70 22.24,70.96 26.14,70.96 27.05,70.05 27.05,56.05 v26,55
  Bottom 0.6: v23.5,41.8 23.23,42.07 23.16,42.07 22.67,42.56 22.67,45.17 26,48.5 v26,55
TS1+
  Top 0.6: IC1.3 48.15,36.92 48.15,37.69 48.47,38 53,38 54.41,36.59 TEMP.2
TS1-
  Top 0.6: IC1.2 46.88,36.92 46.88,37.69 48.2,39 61.87,39 TEMP.1
TS2+
  Top 0.6: IC2.3 48.15,25.69 48.15,24.92 48.42,24.66 52.66,24.66 57,29 57,29.05 TEMP.3
TS2-
  Top 0.6: IC2.2 46.88,25.69 46.88,24.92 47.9,23.91 52.97,23.91 57.75,28.69 57.75,28.74 59.01,30 60.49,30 TEMP.4
XTAL1
  Top 0.6: U1.8 15.41,31.49 15.19,31.71 Q2.1 5.37,31.71 C4.2
XTAL2
  Top 0.6: U1.7 15.67,32.29 15.5,32.46 14.54,32.46 12,35 11.23,35 Q2.2 7.21,36.79 7.2,36.78 C3.2

### Text on the board
tSilk: V 1.1 | (CC) BY-NC